# Altium schematic sheet distance_sensor_v2.SchDoc: Distance Sensor 2
size 290 x 209 mm; ApprovedBy: chs; CheckedBy: chs; Author: chs; CompanyName: chs; DrawnBy: chs; Engineer: chs; Organization: chs; DocumentNumber: 1; Revision: 1; SheetNumber: 1; SheetTotal: 1
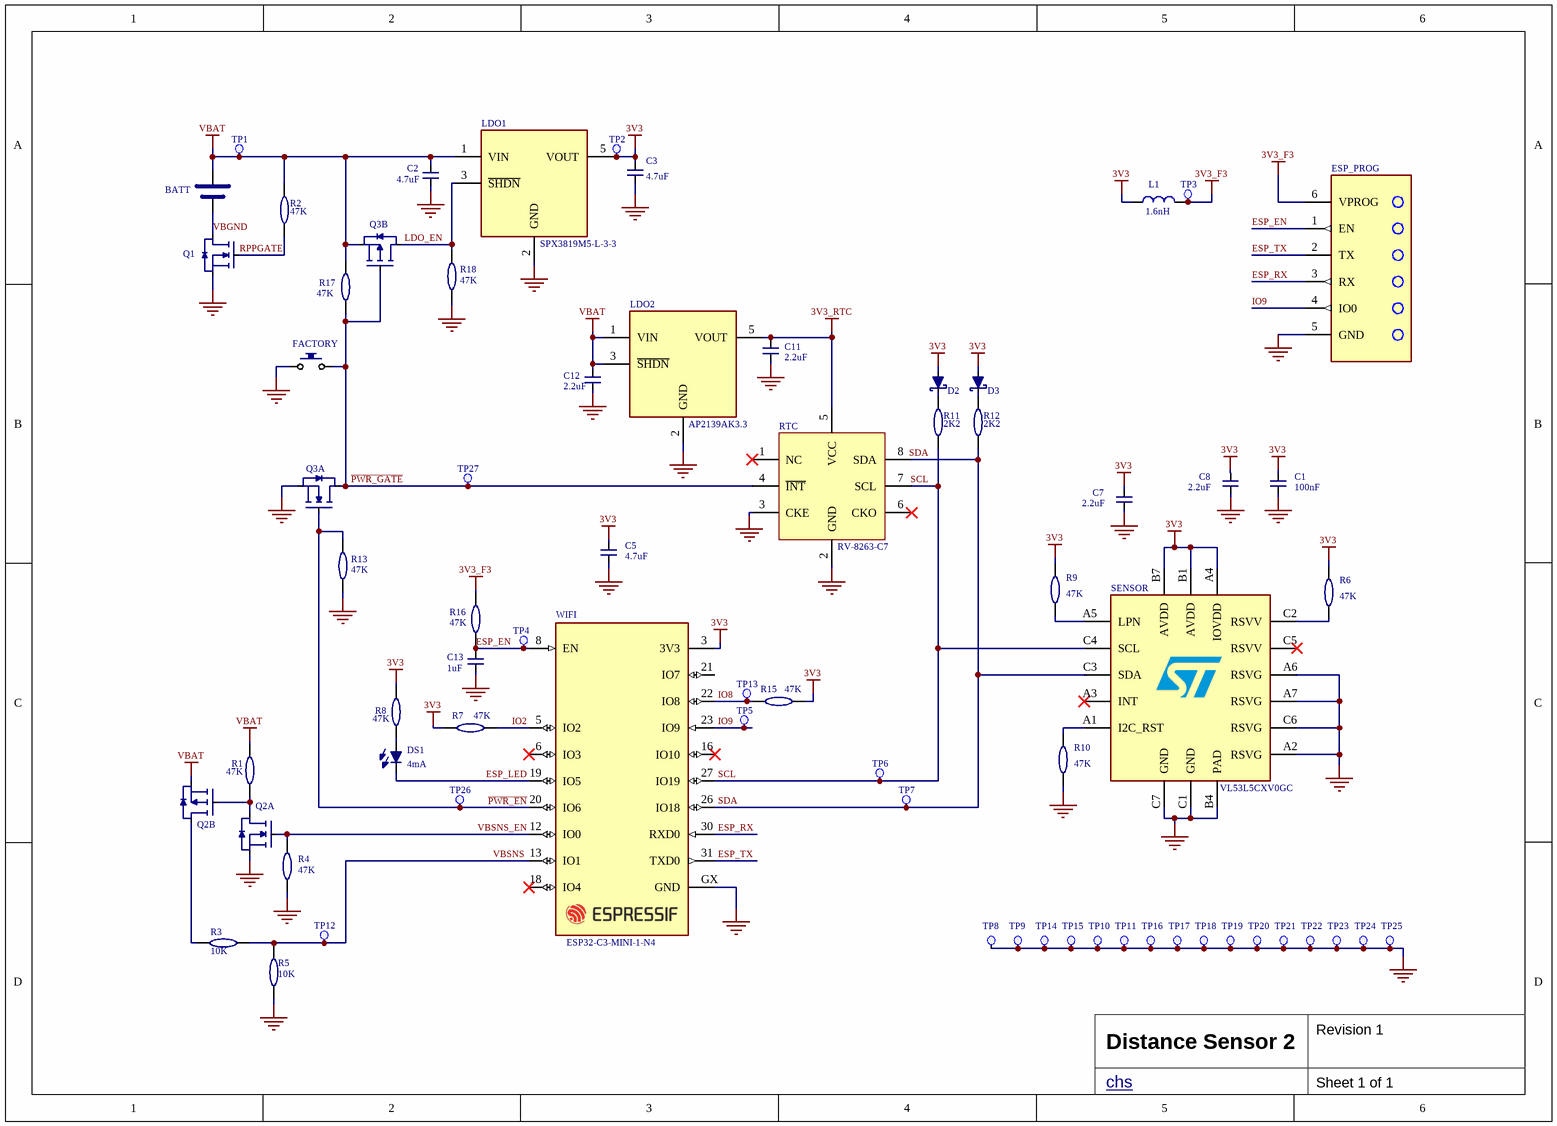
[diagram p0: distance_sensor_v2.SchDoc]

## Parts
BATT  BATTERY  [PP002055]  (value not drawn)  (no BOM)
C1  100nF  [CAP 0805_2012]
C2  4.7uF  [CAP 0805_2012]
C3  4.7uF  [CAP 0805_2012]
C5  4.7uF  [CAP 0805_2012]
C7  2.2uF  [CAP 0805_2012]
C8  2.2uF  [CAP 0805_2012]
C11  2.2uF  [CAP 0805_2012]
C12  2.2uF  [CAP 0805_2012]
C13  1uF  [CAP 0603_1608]
D2  BAT20JFILM  [SODFL250X100-2L]  (value not drawn)
D3  BAT20JFILM  [SODFL250X100-2L]  (value not drawn)
DS1  4mA  [LED 5mm through hole]
ESP_PROG  ESP_PROG  [IDC3X2]  (value not drawn)  (no BOM)
FACTORY  4-1437565-1  [FSM-SWITCH]  (value not drawn)
L1  1.6nH  [INDUCTOR_0603]
LDO1  SPX3819M5-L-3-3  [SOT23-5]
LDO2  AP2139AK3.3  [SOT23-5]
Q1  MOSFET-N  [SOT95P230X110-3L]  (value not drawn)
Q2  MOSFET-NP  [DMG6601LVT]  (value not drawn)  (parts A,B of 2)
Q3  MOSFET-NP  [DMG6601LVT]  (value not drawn)  (parts A,B of 2)
R1  47K  [RES 0603_1608]
R2  47K  [RES 0603_1608]
R3  10K  [RES 0603_1608]
R4  47K  [RES 0603_1608]
R5  10K  [RES 0603_1608]
R6  47K  [RES 0603_1608]
R7  47K  [RES 0603_1608]
R8  47K  [RES 0603_1608]
R9  47K  [RES 0603_1608]
R10  47K  [RES 0603_1608]
R11  2K2  [RES 0603_1608]
R12  2K2  [RES 0603_1608]
R13  47K  [RES 0603_1608]
R15  47K  [RES 0603_1608]
R16  47K  [RES 0603_1608]
R17  47K  [RES 0603_1608]
R18  47K  [RES 0603_1608]
RTC  RV-8263-C7  [RV-8263-C7]
SENSOR  VL53L5CXV0GC  [VL53L5CXV0GC1]
TP1  VBAT  [TESTPOINT]  (value not drawn)  (no BOM)
TP2  3V3  [TESTPOINT]  (value not drawn)  (no BOM)
TP3  3V3_F3  [TESTPOINT]  (value not drawn)  (no BOM)
TP4  EN  [TESTPOINT]  (value not drawn)  (no BOM)
TP5  IO9  [TESTPOINT]  (value not drawn)  (no BOM)
TP6  SCL  [TESTPOINT]  (value not drawn)  (no BOM)
TP7  SDA  [TESTPOINT]  (value not drawn)  (no BOM)
TP8  TESTPOINT  [TESTPAD]  (value not drawn)  (no BOM)
TP9  TESTPOINT  [TESTPAD]  (value not drawn)  (no BOM)
TP10  TESTPOINT  [TESTPAD]  (value not drawn)  (no BOM)
TP11  TESTPOINT  [TESTPAD]  (value not drawn)  (no BOM)
TP12  VBAT_SNS  [TESTPOINT]  (value not drawn)  (no BOM)
TP13  IO8  [TESTPOINT]  (value not drawn)  (no BOM)
TP14  TESTPOINT  [TESTPAD]  (value not drawn)  (no BOM)
TP15  TESTPOINT  [TESTPAD]  (value not drawn)  (no BOM)
TP16  TESTPOINT  [TESTPAD]  (value not drawn)  (no BOM)
TP17  TESTPOINT  [TESTPAD]  (value not drawn)  (no BOM)
TP18  TESTPOINT  [TESTPAD]  (value not drawn)  (no BOM)
TP19  TESTPOINT  [TESTPAD]  (value not drawn)  (no BOM)
TP20  TESTPOINT  [TESTPAD]  (value not drawn)  (no BOM)
TP21  TESTPOINT  [TESTPAD]  (value not drawn)  (no BOM)
TP22  TESTPOINT  [TESTPAD]  (value not drawn)  (no BOM)
TP23  TESTPOINT  [TESTPAD]  (value not drawn)  (no BOM)
TP24  TESTPOINT  [TESTPAD]  (value not drawn)  (no BOM)
TP25  TESTPOINT  [TESTPAD]  (value not drawn)  (no BOM)
TP26  PWR_EN  [TESTPOINT]  (value not drawn)  (no BOM)
TP27  PWR_GT  [TESTPOINT]  (value not drawn)  (no BOM)
WIFI  ESP32-C3-MINI-1-N4  [XCVR_ESP32-C3-MINI-1-N4]

## Nets
3V3: C1.2(B) C3.2(B) C5.2(B) C7.2(B) C8.2(B) D2.2(A) D3.2(A) L1.1 LDO1.5(VOUT) R6.2(B) R7.2(B) R8.2(B) R9.2(B) R15.2(B) SENSOR.A4(IOVDD) SENSOR.B1(AVDD) SENSOR.B7(AVDD) TP2.1(TP) WIFI.3(3V3)
3V3_F3: ESP_PROG.6(VPROG) L1.2 R16.2(B) TP3.1(TP)
3V3_RTC: C11.2(B) LDO2.5(VOUT) RTC.5(VCC)
GND: C1.1(A) C2.1(A) C3.1(A) C5.1(A) C7.1(A) C8.1(A) C11.1(A) C12.1(A) C13.1(A) ESP_PROG.5(GND) FACTORY.1 LDO1.2(GND) LDO2.2(GND) Q1.2(S) Q2.S1(S) Q3.S1(S) R4.1(A) R5.1(A) R10.1(A) R13.1(A) R18.1(A) RTC.2(GND) RTC.3(CKE) SENSOR.A2(RSVG) SENSOR.A6(RSVG) SENSOR.A7(RSVG) SENSOR.B4(PAD) SENSOR.C1(GND) SENSOR.C6(RSVG) SENSOR.C7(GND) TP8.1(TP) TP9.1(TP) TP10.1(TP) TP11.1(TP) TP14.1(TP) TP15.1(TP) TP16.1(TP) TP17.1(TP) TP18.1(TP) TP19.1(TP) TP20.1(TP) TP21.1(TP) TP22.1(TP) TP23.1(TP) TP24.1(TP) TP25.1(TP) WIFI.GX(GND)
VBAT: BATT.VPOS(+) C2.2(B) C12.2(B) LDO1.1(VIN) LDO2.1(VIN) LDO2.3(~{SHDN}) Q2.S2(S) Q3.S2(S) R1.2(B) R2.2(B) R17.2(B) TP1.1(TP)
~{PWR_EN}: Q3.G1(G) R13.2(B) TP26.1(TP) WIFI.20(IO6)
~{PWR_GATE}: FACTORY.2 Q3.D1(D) Q3.G2(G) R17.1(A) RTC.4(~{INT}) TP27.1(TP)
ESP_EN: C13.2(B) ESP_PROG.1(EN) R16.1(A) TP4.1(TP) WIFI.8(EN)
ESP_LED: DS1.2(CATHODE) WIFI.19(IO5)
ESP_RX: ESP_PROG.3(RX) WIFI.30(RXD0)
ESP_TX: ESP_PROG.2(TX) WIFI.31(TXD0)
IO2: R7.1(A) WIFI.5(IO2)
IO8: R15.1(A) TP13.1(TP) WIFI.22(IO8)
IO9: ESP_PROG.4(IO0) TP5.1(TP) WIFI.23(IO9)
LDO_EN: LDO1.3(~{SHDN}) Q3.D2(D) R18.2(B)
RPPGATE: Q1.1(G) R2.1(A)
SCL: R11.1(A) RTC.7(SCL) SENSOR.C4(SCL) TP6.1(TP) WIFI.27(IO19)
SDA: R12.1(A) RTC.8(SDA) SENSOR.C3(SDA) TP7.1(TP) WIFI.26(IO18)
VBGND: BATT.VNEG(-) Q1.3(D)
VBSNS: R3.1(A) R5.2(B) TP12.1(TP) WIFI.13(IO1)
VBSNS_EN: Q2.G1(G) R4.2(B) WIFI.12(IO0)
NetD2_1: D2.1(C) R11.2(B)
NetD3_1: D3.1(C) R12.2(B)
NetDS1_1: DS1.1(ANODE) R8.1(A)
NetQ2_D1: Q2.D1(D) Q2.G2(G) R1.1(A)
NetQ2_D2: Q2.D2(D) R3.2(B)
NetR6_1: R6.1(A) SENSOR.C2(RSVV)
NetR9_1: R9.1(A) SENSOR.A5(LPN)
NetR10_2: R10.2(B) SENSOR.A1(I2C_RST)

Not connected (* = marked no-connect by the designer): RTC 1(NC)* 6(CKO)*; SENSOR A3(INT)* C5(RSVV)*; WIFI 6(IO3)* 16(IO10)* 18(IO4)* 21(IO7)

## Library data of the parts
C1-C3 C5 C7 C8 C11-C13 = CAP_CERAMIC: MLCC; LCSC Part Number: *; Tolerance: *; Voltage: *; Package: *; Dielectric: *
  C1: Value: 100nF
  C2 C3 C5: Value: 4.7uF
  C7 C8 C11 C12: Value: 2.2uF
  C13: Value: 1uF
D2 D3 = BAT20JFILM: Schottky Diode 20v 500mA
DS1 = LED: Value: 4mA; LCSC Part Number: *
FACTORY = BUTTON: 6x6mm tactile switch SPST_NO; Manufacturer_Name: TE Connectivity; Allied_Number: R1117787; RS Part Number: 1616046; Manufacturer_Part_Number: 4-1437565-1; Datasheet Link: http://uk.rs-online.com/web/p/products/1616046
L1 = INDUCTOR: MPN: 744313330; Vendor: Wurth Elektronik; RefDes: RefDes; TYPE: TYPE; Value: 1.6nH
LDO1 LDO2 = LDO_SOT23-5
  LDO1: MPN: SPX3819M5-L-3-3
  LDO2: MPN: AP2139AK3.3
Q1 = MOSFET-N: N Channel MOSFET. 300mA
Q2 Q3 = MOSFET-NP: N/P Channel MOSFET; pin to pad: D1>6 D2>4 G1>1 G2>3 S1>5 S2>2; Manufacturer Part Number: DMC2400UV-13; LCSC Part Number: C500791
R1-R13 R15-R18 = RESISTOR: LCSC Part Number: *; Tolerance: *; Package: *; Power: *
  R1 R2 R4 R6-R10 R13 R15-R18: Value: 47K
  R3 R5: Value: 10K
  R11 R12: Value: 2K2
RTC = RV-8263-C7: Real-Time Clock Module; MPN: RV-8263-C7
SENSOR = VL53L5CXV0GC: TOF distance sensor; Manufacturer_Name: STMicroelectronics; Manufacturer_Part_Number: VL53L5CXV0GC/1; Geometry.Height: 1.55mm; Mouser Part Number: 511-VL53L5CXV0GC/1; Mouser Price/Stock: https://www.mouser.co.uk/ProductDetail/STMicroelectronics/VL53L5CXV0GC-1?qs=QNEnbhJQKvZPmRJw6ASPyw%3D%3D; Arrow Part Number: VL53L5CXV0GC/1; Arrow Price/Stock: https://www.arrow.com/en/products/vl53l5cxv0gc1/stmicroelectronics?region=nac; Datasheet Link: https://www.arrow.com/en/products/vl53l5cxv0gc1/stmicroelectronics?region=nac; MPN: VL53L5CXV0GC
TP1-TP3 TP6-TP12 TP14-TP25 = TESTPOINT: TestID: ???
TP4 TP13 TP26 TP27 = TESTPOINT: TestID: IO9
TP5 = TESTPOINT: TestID: IO9
WIFI = ESP32-C3-MINI-1-N4: Wifi module ESP32-C3; MF: Espressif Systems; SnapEDA_Link: https://www.snapeda.com/parts/ESP32-C3-MINI-1-N4/Espressif+Systems/view-part/?ref=snap; Package: SMD-53 Espressif Systems; Check_prices: https://www.snapeda.com/parts/ESP32-C3-MINI-1-N4/Espressif+Systems/view-part/?ref=eda; Purchase-URL: https://pricing.snapeda.com/search/part/ESP32-C3-MINI-1-N4/?ref=eda; Price: None; Value: *; Availability: In Stock; MPN: ESP32-C3-MINI-1-N4